# EAGLE design EEPROM SMD Breakout WP Pin (EAGLE 8.4.0)
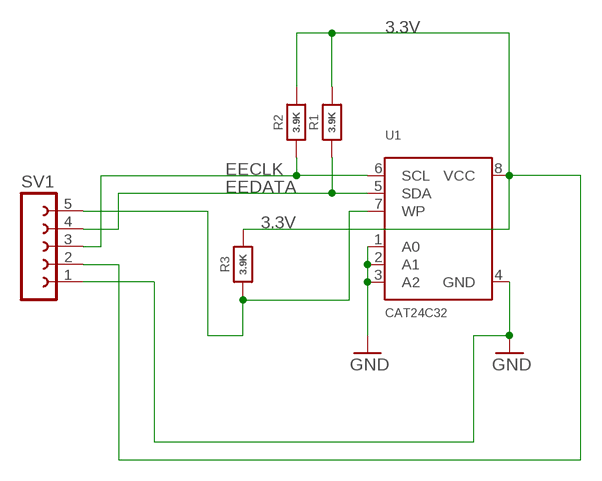
[diagram p0: schematic, sheet 1]

## Parts
R1  3.9K  RESISTOR0805_NOOUTLINE  [0805-NO]
R2  3.9K  RESISTOR0805_NOOUTLINE  [0805-NO]
R3  3.9K  RESISTOR0805_NOOUTLINE  [0805-NO]
SV1  FE05-1  [FE05-1]
U1  CAT24C32  EEPROM_I2C_SOIC8_GENERIC  [SOIC8_150MIL]

## Nets
3.3V: R1.2 R2.2 R3.2 SV1.2 U1.8(VCC)
EECLK: R2.1 SV1.3 U1.6(SCL)
EEDATA: R1.1 SV1.4 U1.5(SDA)
GND: SV1.1 U1.1(A0) U1.2(A1) U1.3(A2) U1.4(GND)
N$16: R3.1 SV1.5 U1.7(WP)

## Library data of the parts
R1-R3 = microbuilder:RESISTOR: Resistors For new designs, use the packages preceded by an '_' character since they are more reliable: The following footprints should be used on most boards: _0402 - Standard footprint for regular board layouts _0603 - Standard footprint for regular board layouts _0805 - Standard footprint for regular board layouts _1206 - Standard footprint for regular board layouts For extremely tight-pitch boards where space is at a premium, the following 'micro-pitch' footprints can be used (smaller pads, no silkscreen outline, etc.): _0402MP - Micro-pitch footprint for very dense/compact boards _0603MP - Micro-pitch footprint for very dense/compact boards _0805MP - Micro-pitch footprint for very dense/compact boards _1206MP - Micro-pitch footprint for very dense/compact boards
SV1 = con-lsta:FE05-1: FEMALE HEADER; OC_FARNELL: unknown; OC_NEWARK: unknown; SPICEPREFIX: S
U1 = microbuilder:EEPROM_I2C_SOIC8_GENERIC: Note: The same pinout is used for many I2C EEPROMs in SOIC8(150mil) from a variety of manufacturers and in various sizes. Examples: 16K (2K x 8 Bit) I2C EEPROM 1.7-5.5V, 400KHz, -40°C-85°C Digikey: CAT24C16WI-GT3CT-ND 256K (32K x 8 Bit) I2C EEPROM 1.7-5.5V, 400KHz, -40°C-85°C Digikey: 24AA256-I/SN-ND

## Board
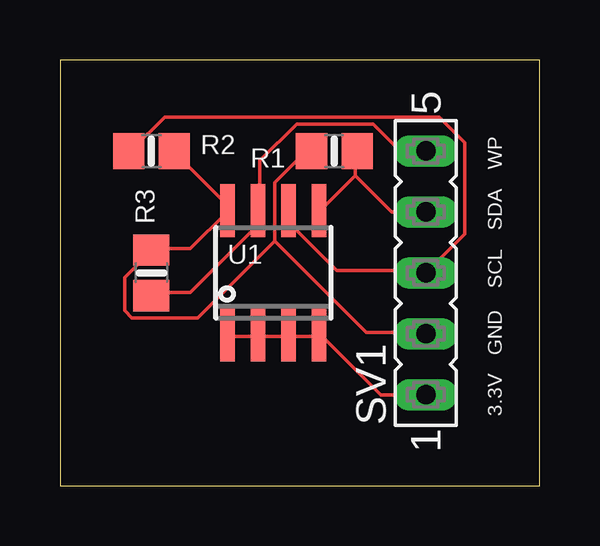
[diagram p1: board, top side]

Size 19.99 x 17.77 mm. Coordinates in mm from the lower left corner, seen from the top.
Outline: 0,0 19.99,0 19.99,17.77 0,17.77 0,0
Copper layers (1*16): Top 0.035mm / dielectric 1.5mm / Bottom 0.035mm
Design rules "default": minimum track width 6mil, minimum drill 0.35mm, track to track 6mil, track to pad 6mil, pad to pad 6mil, via to via 6mil, smd to smd 6mil, copper to edge 40mil, drill to drill 6mil, minimum pad ring 10mil, minimum via ring 8mil, stop-mask expansion 4mil, vias tented up to drill 0mil, thermal gap 10mil

### Footprints (pad centres in the part's own frame; a part is rotated, then mirrored left to right if it is on the bottom)
0805-NO = smd 1.3 x 1.5: 1 -0.95,0; 2 0.95,0
FE05-1 = drill 0.813 long: 1 -5.08,0; 2 -2.54,0; 3 0,0; 4 2.54,0; 5 5.08,0
SOIC8_150MIL = smd 0.6 x 2.2: 1 -1.905,-2.6; 2 -0.635,-2.6; 3 0.635,-2.6; 4 1.905,-2.6; 5 1.905,2.6; 6 0.635,2.6; 7 -0.635,2.6; 8 -1.905,2.6

### Placement (x,y rotation side)
R1  11.43,13.97 180 top
R2  3.81,13.97 0 top
R3  3.81,8.89 90 top
SV1  15.24,8.89 90 top
U1  8.89,8.89 0 top

### Tracks (layer width: path | path; a pad name or v marks a point on that pad's centre or on a via)
3.3V
  Top 0.152: R2.2 4.83,13.87 7.11,11.58 U1.8 6.96,11.43 5.44,9.91 3.91,9.91 R3.2 3.76,9.75 2.69,8.69 2.69,7.31 3,7.01 5.74,7.01 8.94,10.21 | 8.94,10.21 8.94,12.65 10.16,13.87 10.47,13.87 R1.2 | 8.94,10.21 12.75,6.4 15.19,6.4 SV1.2
EECLK
  Top 0.152: R2.1 3,14.02 4.37,15.39 15.8,15.39 16.87,14.33 16.87,10.52 SV1.3 15.19,8.99 11.53,8.99 9.55,10.97 9.55,11.43 U1.6
EEDATA
  Top 0.152: 12.29,12.95 12.29,13.87 R1.1 | 12.29,12.95 10.92,11.58 U1.5 | SV1.4 13.82,11.43 12.29,12.95
GND
  Top 0.152: U1.1 7.11,6.25 8.18,6.25 U1.2 8.33,6.25 9.4,6.25 U1.3 9.55,6.25 10.77,6.25 U1.4 10.92,6.25 13.36,3.81 SV1.1
N$16
  Top 0.152: R3.1 3.91,8.08 5.44,8.08 8.18,10.82 8.18,11.43 U1.7 8.33,11.58 8.33,13.56 9.85,15.09 13.06,15.09 14.12,14.02 15.19,14.02 SV1.5

### Text on the board
tPlace: WP | SDA | SCL | GND | 3.3V